# Altium schematic sheet DSPA.SCHDOC
size B
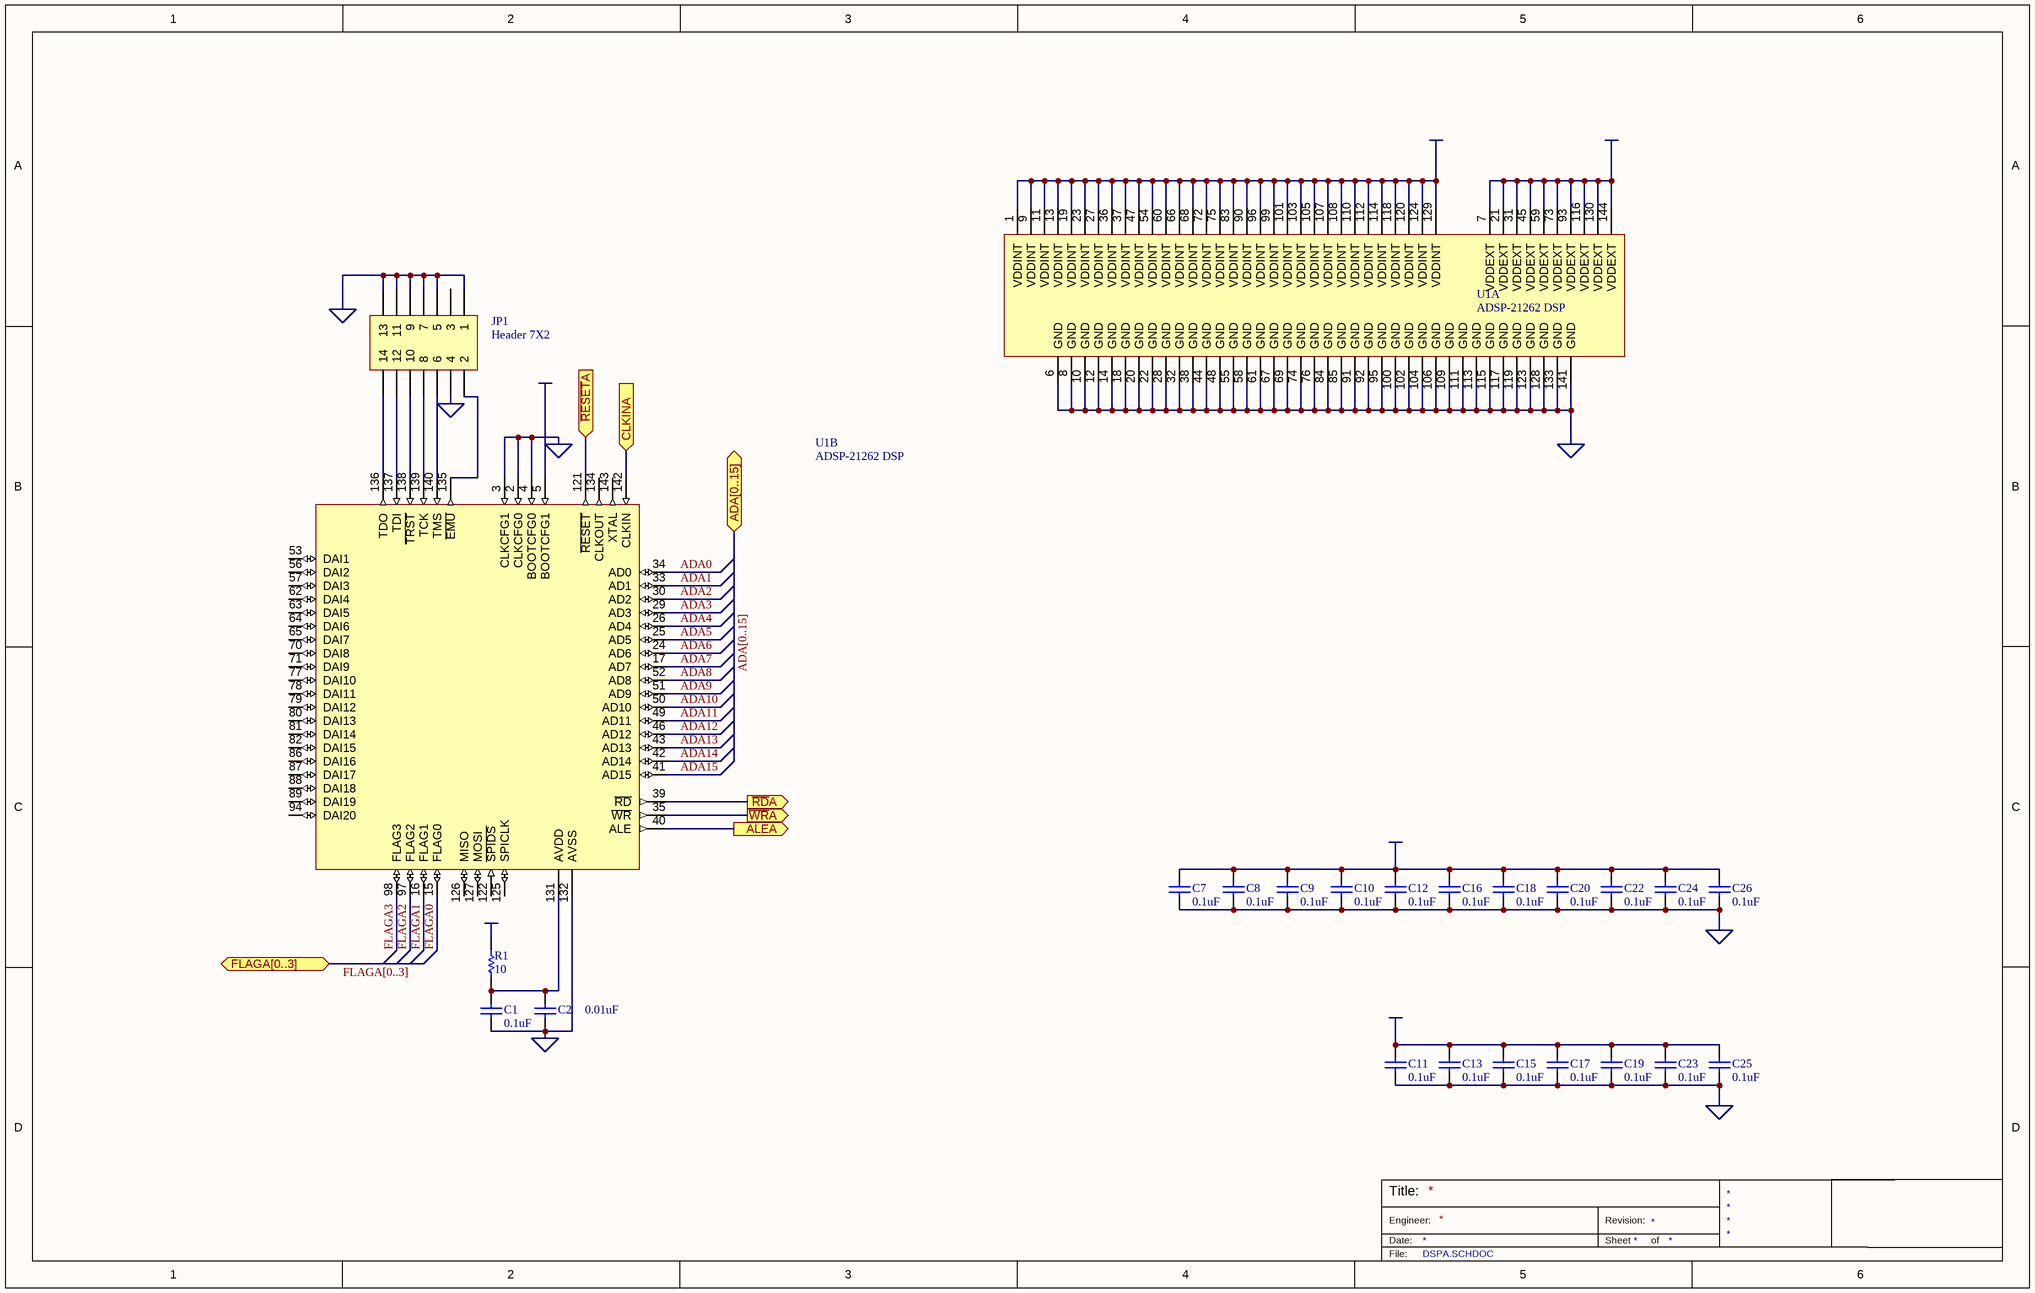
[diagram p0: DSPA.SCHDOC]

## Parts
C1  value 0.1uF  [CC1005-0402]  (hidden comment: Cap)
C2  value 0.01uF  [CC1005-0402]  (hidden comment: Cap)
C7  value 0.1uF  [CC1005-0402]  (hidden comment: Cap)
C8  value 0.1uF  [CC1005-0402]  (hidden comment: Cap)
C9  value 0.1uF  [CC1005-0402]  (hidden comment: Cap)
C10  value 0.1uF  [CC1005-0402]  (hidden comment: Cap)
C11  value 0.1uF  [CC1005-0402]  (hidden comment: Cap)
C12  value 0.1uF  [CC1005-0402]  (hidden comment: Cap)
C13  value 0.1uF  [CC1005-0402]  (hidden comment: Cap)
C15  value 0.1uF  [CC1005-0402]  (hidden comment: Cap)
C16  value 0.1uF  [CC1005-0402]  (hidden comment: Cap)
C17  value 0.1uF  [CC1005-0402]  (hidden comment: Cap)
C18  value 0.1uF  [CC1005-0402]  (hidden comment: Cap)
C19  value 0.1uF  [CC1005-0402]  (hidden comment: Cap)
C20  value 0.1uF  [CC1005-0402]  (hidden comment: Cap)
C22  value 0.1uF  [CC1005-0402]  (hidden comment: Cap)
C23  value 0.1uF  [CC1005-0402]  (hidden comment: Cap)
C24  value 0.1uF  [CC1005-0402]  (hidden comment: Cap)
C25  value 0.1uF  [CC1005-0402]  (hidden comment: Cap)
C26  value 0.1uF  [CC1005-0402]  (hidden comment: Cap)
JP1  Header 7X2  [HDR2X7]
R1  value 10  [CR1608-0603]  (hidden comment: Res1)
U1  ADSP-21262 DSP  [F-QFP20X20-G144/N]  (parts A,B of 2)

## Ports
ADA[0..15] (bidir), ALEA (out), CLKINA (in), FLAGA[0..3] (bidir), ~{RD}A (out), ~{RESET}A (in), ~{WR}A (out)

## Nets
+1.2VCC: C7.2 C8.2 C9.2 C10.2 C12.2 C16.2 C18.2 C20.2 C22.2 C24.2 C26.2 R1.1 U1.1(VDDINT) U1.9(VDDINT) U1.11(VDDINT) U1.13(VDDINT) U1.19(VDDINT) U1.23(VDDINT) U1.27(VDDINT) U1.36(VDDINT) U1.37(VDDINT) U1.47(VDDINT) U1.54(VDDINT) U1.60(VDDINT) U1.66(VDDINT) U1.68(VDDINT) U1.72(VDDINT) U1.75(VDDINT) U1.83(VDDINT) U1.90(VDDINT) U1.96(VDDINT) U1.99(VDDINT) U1.101(VDDINT) U1.103(VDDINT) U1.105(VDDINT) U1.107(VDDINT) U1.108(VDDINT) U1.110(VDDINT) U1.112(VDDINT) U1.114(VDDINT) U1.118(VDDINT) U1.120(VDDINT) U1.124(VDDINT) U1.129(VDDINT)
GND: C1.1 C2.1 C7.1 C8.1 C9.1 C10.1 C11.1 C12.1 C13.1 C15.1 C16.1 C17.1 C18.1 C19.1 C20.1 C22.1 C23.1 C24.1 C25.1 C26.1 JP1.1 JP1.4 JP1.5 JP1.7 JP1.9 JP1.11 JP1.13 U1.2(CLKCFG0) U1.3(CLKCFG1) U1.4(BOOTCFG0) U1.6(GND) U1.8(GND) U1.10(GND) U1.12(GND) U1.14(GND) U1.18(GND) U1.20(GND) U1.22(GND) U1.28(GND) U1.32(GND) U1.38(GND) U1.44(GND) U1.48(GND) U1.55(GND) U1.58(GND) U1.61(GND) U1.67(GND) U1.69(GND) U1.74(GND) U1.76(GND) U1.84(GND) U1.85(GND) U1.91(GND) U1.92(GND) U1.95(GND) U1.100(GND) U1.102(GND) U1.104(GND) U1.106(GND) U1.109(GND) U1.111(GND) U1.113(GND) U1.115(GND) U1.117(GND) U1.119(GND) U1.123(GND) U1.128(GND) U1.132(AVSS) U1.133(GND) U1.141(GND)
VCC: C11.2 C13.2 C15.2 C17.2 C19.2 C23.2 C25.2 U1.5(BOOTCFG1) U1.7(VDDEXT) U1.21(VDDEXT) U1.31(VDDEXT) U1.45(VDDEXT) U1.59(VDDEXT) U1.73(VDDEXT) U1.93(VDDEXT) U1.116(VDDEXT) U1.130(VDDEXT) U1.144(VDDEXT)
ADA0: U1.34(AD0)
ADA1: U1.33(AD1)
ADA2: U1.30(AD2)
ADA3: U1.29(AD3)
ADA4: U1.26(AD4)
ADA5: U1.25(AD5)
ADA6: U1.24(AD6)
ADA7: U1.17(AD7)
ADA8: U1.52(AD8)
ADA9: U1.51(AD9)
ADA10: U1.50(AD10)
ADA11: U1.49(AD11)
ADA12: U1.46(AD12)
ADA13: U1.43(AD13)
ADA14: U1.42(AD14)
ADA15: U1.41(AD15)
ALEA: U1.40(ALE) ; port ALEA
CLKINA: U1.142(CLKIN) ; port CLKINA
FLAGA0: U1.15(FLAG0)
FLAGA1: U1.16(FLAG1)
FLAGA2: U1.97(FLAG2)
FLAGA3: U1.98(FLAG3)
~{RD}A: U1.39(~{RD}) ; port ~{RD}A
~{RESET}A: U1.121(~{RESET}) ; port ~{RESET}A
~{WR}A: U1.35(~{WR}) ; port ~{WR}A
NetC1_2: C1.2 C2.2 R1.2 U1.131(AVDD)
NetJP1_2: JP1.2 U1.135(~{EMU})
NetJP1_6: JP1.6 U1.140(TMS)
NetJP1_8: JP1.8 U1.139(TCK)
NetJP1_10: JP1.10 U1.138(~{TRST})
NetJP1_12: JP1.12 U1.137(TDI)
NetJP1_14: JP1.14 U1.136(TDO)

Not connected (* = marked no-connect by the designer): JP1 3; U1 53(DAI1) 56(DAI2) 57(DAI3) 62(DAI4) 63(DAI5) 64(DAI6) 65(DAI7) 70(DAI8) 71(DAI9) 77(DAI10) 78(DAI11) 79(DAI12) 80(DAI13) 81(DAI14) 82(DAI15) 86(DAI16) 87(DAI17) 88(DAI18) 89(DAI19) 94(DAI20) 122(~{SPIDS}) 125(SPICLK) 126(MISO) 127(MOSI) 134(CLKOUT) 143(XTAL)

## Buses and harness runs
bus ADA[0..15] = port ADA[0..15]
bus FLAGA[0..3] = port FLAGA[0..3]

## Notes on the sheet
- Title:
- Engineer:
- Date:
- Revision:
- Sheet
- of
- File:

## Library data of the parts
C1 C2 C7-C13 C15-C20 C22-C26 = Cap: Capacitor; Manufacturer: Generic Components; Class I: Passive; Published: 8-Jun-2000; Revision: July-2002: Re-released for DXP Platform.; Publisher: Altium Limited; Class II: Capacitor
JP1 = Header 7X2: Header, 7-Pin, Dual row; Manufacturer: Generic Components; Class I: Connector; Revision: July-2002: Re-released for DXP Platform.; Publisher: Altium Limited
R1 = Res1: Resistor; Manufacturer: Generic Components; Class I: Passive; Published: 8-Jun-2000; Revision: July-2002: Re-released for DXP Platform.; Publisher: Altium Limited; Class II: Resistor
U1 = ADSP-21262: SHARC 200 MHz 32-bit floating-point SIMD DSP